# Altium schematic sheet Sheet2.SCHDOC
size 431 x 279 mm; SheetNumber: 0; SheetTotal: 0
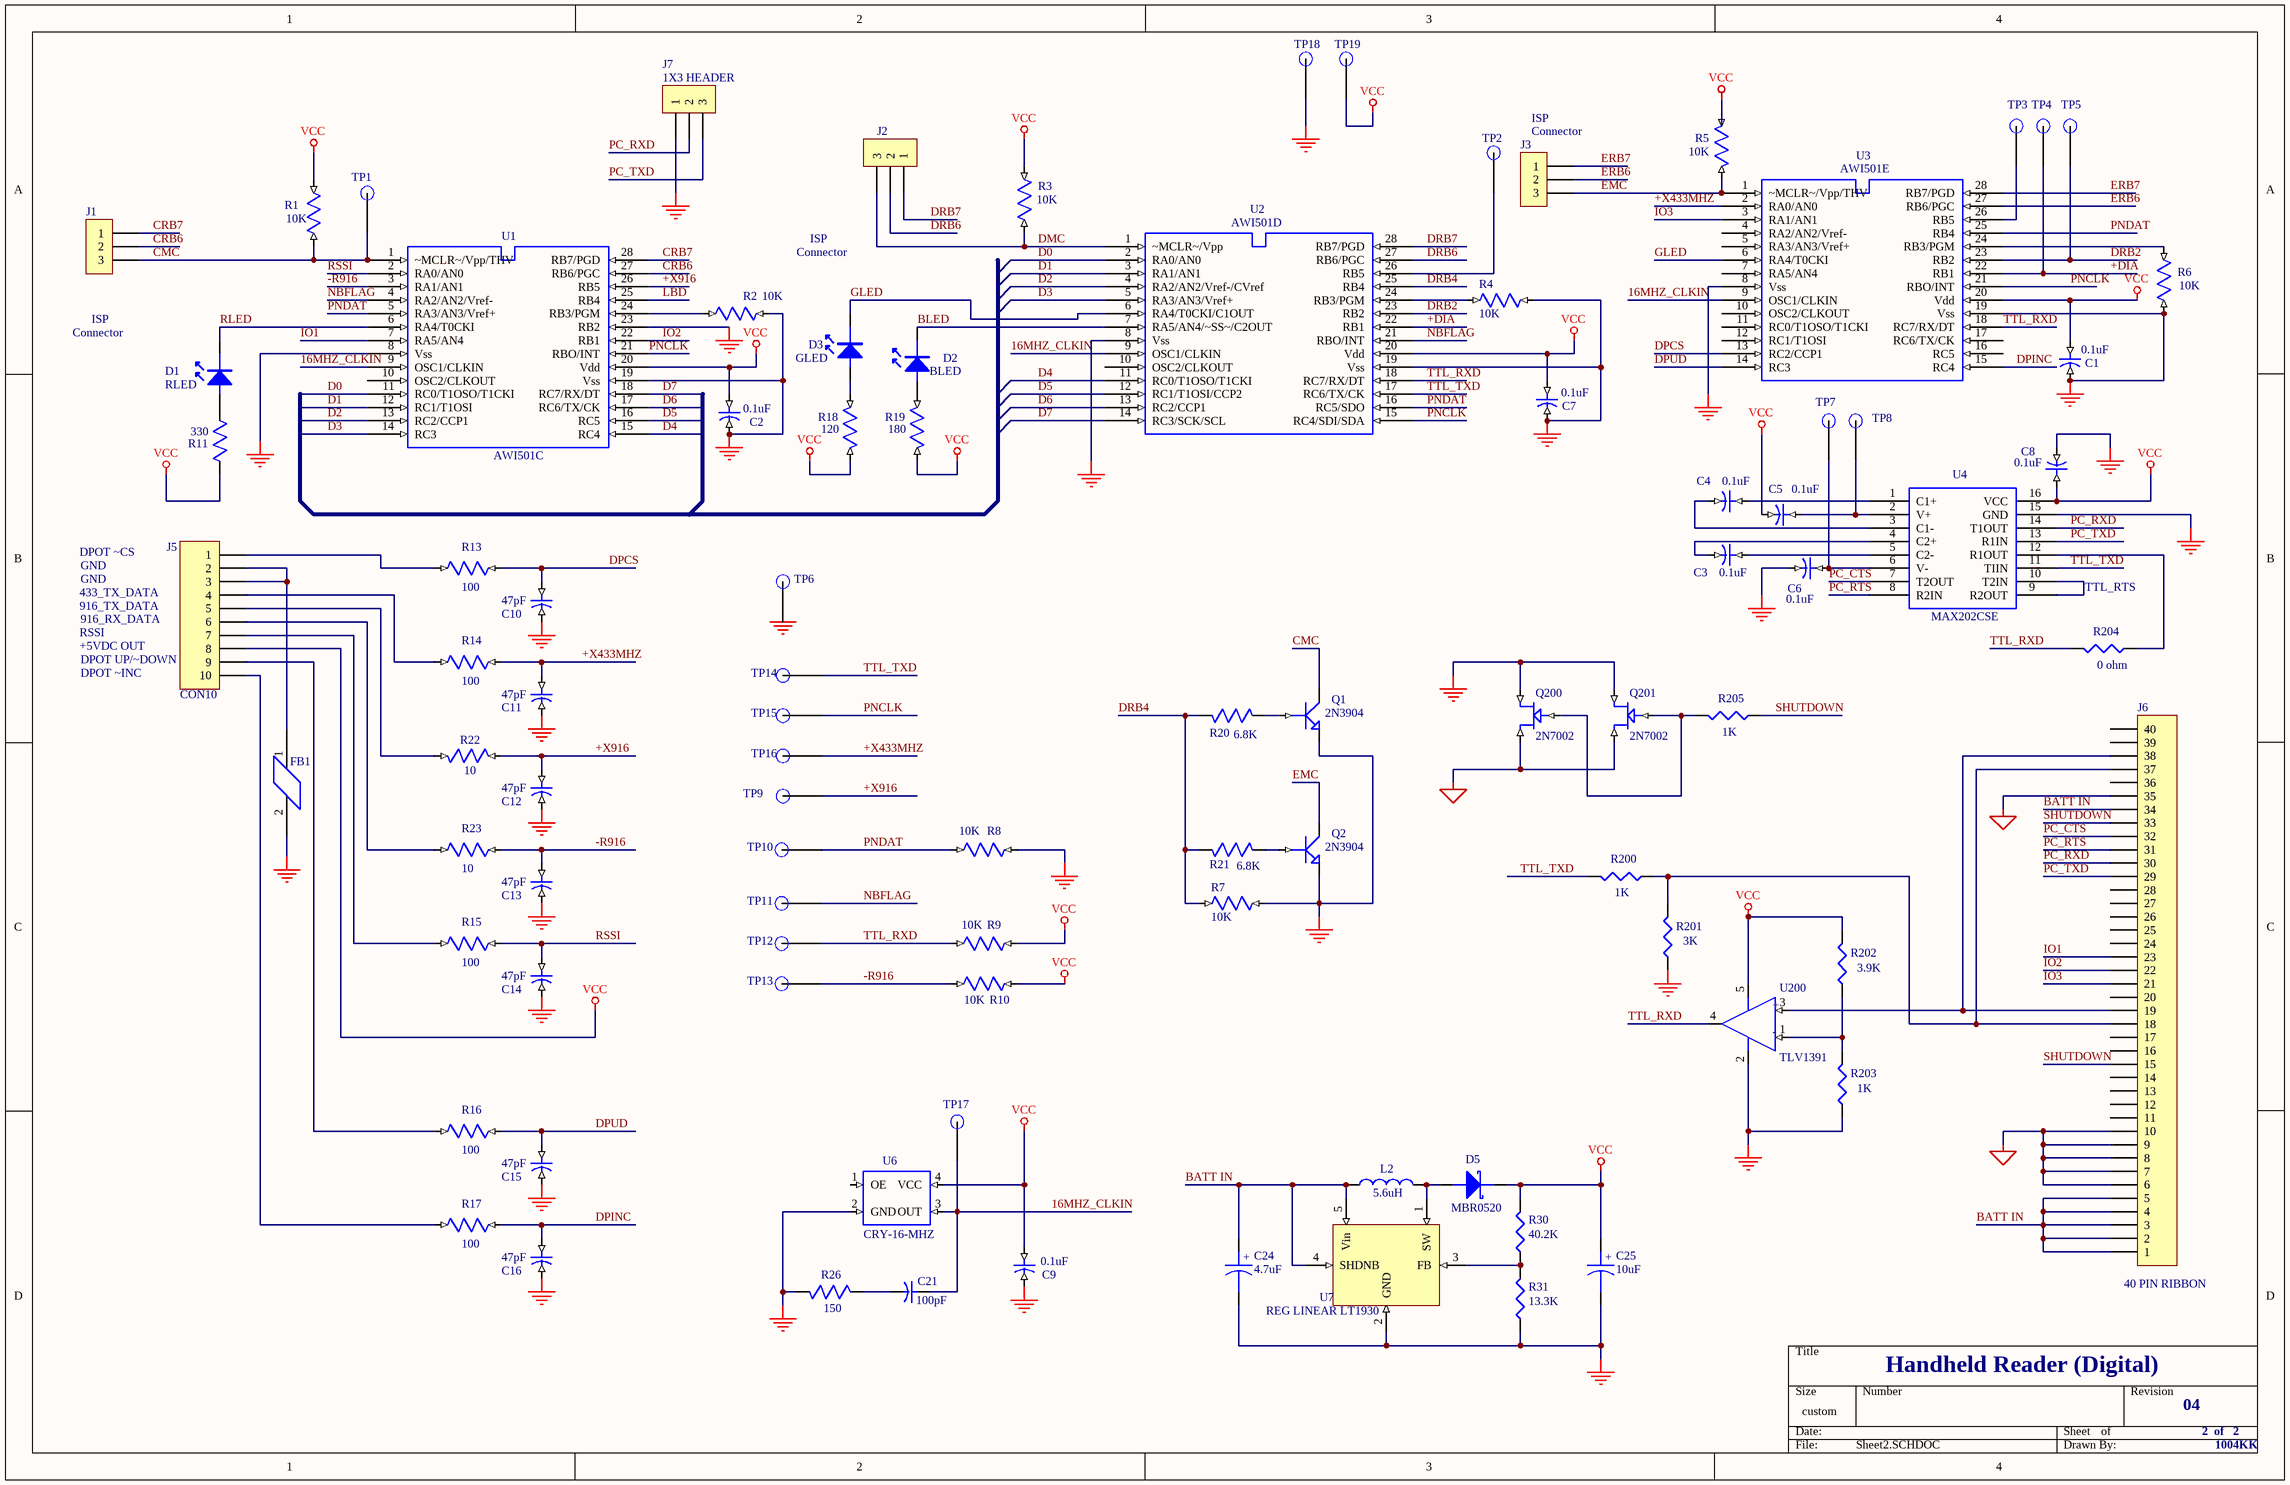
[diagram p0: Sheet2.SCHDOC]

## Parts
C1  0.1uF  [0603]
C2  0.1uF  [0603]
C3  0.1uF  [0603]
C4  0.1uF  [0603]
C5  0.1uF  [0603]
C6  0.1uF  [0603]
C7  0.1uF  [0603]
C8  0.1uF  [0603]
C9  0.1uF  [0603]
C10  47pF  [0603]
C11  47pF  [0603]
C12  47pF  [0603]
C13  47pF  [0603]
C14  47pF  [0603]
C15  47pF  [0603]
C16  47pF  [0603]
C21  100pF  [0603]
C24  4.7uF  [CAP A CASE]
C25  10uF  [CAP A CASE]
D1  RLED  [SOD123 DIODE]
D2  BLED  [SOD123 DIODE]
D3  GLED  [SOD123 DIODE]
D5  MBR0520  [SOD123]
FB1  FB 0603  [0603]  (value not drawn)
J1  1X3 HEADER  [1X3 HEADER]  (value not drawn)
J2  1X3 HEADER  [1X3 HEADER]  (value not drawn)
J3  1X3 HEADER  [1X3 HEADER]  (value not drawn)
J5  CON10  [1X10 HEADER SPECIAL]
J6  40 PIN RIBBON  [40 PIN RIBBON CONN]
J7  1X3 HEADER  [1X3 HEADER]
L2  5.6uH  [COIL BOURNS SDR7030-330M]
Q1  2N3904  [SOT23 TRANS]
Q2  2N3904  [SOT23 TRANS]
Q200  2N7002  [SOT23 FET]
Q201  2N7002  [SOT23 FET]
R1  10K  [0603]
R2  10K  [0603]
R3  10K  [0603]
R4  10K  [0603]
R5  10K  [0603]
R6  10K  [0603]
R7  10K  [0603]
R8  10K  [0603]
R9  10K  [0603]
R10  10K  [0603]
R11  330  [0603]
R13  100  [0603]
R14  100  [0603]
R15  100  [0603]
R16  100  [0603]
R17  100  [0603]
R18  120  [0603]
R19  180  [0603]
R20  6.8K  [0603]
R21  6.8K  [0603]
R22  10  [0603]
R23  10  [0603]
R26  150  [0603]
R30  40.2K  [0603]
R31  13.3K  [0603]
R200  1K  [0603]
R201  3K  [0603]
R202  3.9K  [0603]
R203  1K  [0603]
R204  0 ohm  [0603]
R205  1K  [0603]
TP1  TP  [TEST POINT PAD]  (value not drawn)
TP2  TP  [TEST POINT PAD]  (value not drawn)
TP3  TP  [TEST POINT PAD]  (value not drawn)
TP4  TP  [TEST POINT PAD]  (value not drawn)
TP5  TP  [TEST POINT PAD]  (value not drawn)
TP6  TP  [TEST POINT PAD]  (value not drawn)
TP7  TP  [TEST POINT PAD]  (value not drawn)
TP8  TP  [TEST POINT PAD]  (value not drawn)
TP9  TP  [TEST POINT PAD]  (value not drawn)
TP10  TP  [TEST POINT PAD]  (value not drawn)
TP11  TP  [TEST POINT PAD]  (value not drawn)
TP12  TP  [TEST POINT PAD]  (value not drawn)
TP13  TP  [TEST POINT PAD]  (value not drawn)
TP14  TP  [TEST POINT PAD]  (value not drawn)
TP15  TP  [TEST POINT PAD]  (value not drawn)
TP16  TP  [TEST POINT PAD]  (value not drawn)
TP17  TP  [TEST POINT PAD]  (value not drawn)
TP18  TP  [TEST POINT PAD]  (value not drawn)
TP19  TP  [TEST POINT PAD]  (value not drawn)
U1  AWI501C  [SSOP28]
U2  AWI501D  [SSOP28]
U3  AWI501E  [SSOP28]
U4  MAX202CSE  [SO16]
U6  CRY-16-MHZ  [SMT OSCILLATOR]
U7  REG LINEAR LT1930  [SOT23-5A]
U200  TLV1391  [SOT25]

## Nets
GND1: J6.6 J6.7 J6.8 J6.9 J6.10 J6.35 Q200.S Q201.S
GND_COM: C1.2(B) C2.2(B) C6.2(B) C7.2(B) C8.2(B) C9.2(B) C10.2(B) C11.2(B) C12.2(B) C13.2(B) C14.2(B) C15.2(B) C16.2(B) C24.2 C25.2 FB1.2 J7.1 Q1.E Q2.E Q200.D Q201.D R2.2(B) R4.1(A) R6.2(B) R7.2(B) R8.1(A) R26.2(B) R31.1 R201.1 R203.1 TP6.1(TP) TP18.1(TP) U1.8(Vss) U1.19(Vss) U1.23(RB2) U2.8(Vss) U2.19(Vss) U3.8(Vss) U3.19(Vss) U4.15(GND) U6.2(GND) U7.2(GND) U200.2(VSS)
VCC: C1.1(A) C2.1(A) C5.2(B) C7.1(A) C8.1(A) C9.1(A) C25.1 D5.K J5.8 R1.1(A) R3.1(A) R5.1(A) R9.1(A) R10.1(A) R11.1(A) R18.1(A) R19.1(A) R30.2 R202.2 TP19.1(TP) U1.20(Vdd) U2.20(Vdd) U3.20(Vdd) U4.16(VCC) U6.4(VCC) U200.5(VDD)
16MHZ_CLKIN: C21.1(A) TP17.1(TP) U1.9(OSC1/CLKIN) U2.9(OSC1/CLKIN) U3.9(OSC1/CLKIN) U6.3(OUT)
+DIA: TP4.1(TP) U2.22(RB1) U3.22(RB1)
+X433MHZ: C11.1(A) R14.2(B) TP16.1(TP) U3.2(RA0/AN0)
+X916: C12.1(A) R22.1(A) TP9.1(TP) U1.26(RB5)
-R916: C13.1(A) R10.2(B) R23.2(B) TP13.1(TP) U1.3(RA1/AN1)
BATT IN: C24.1 J6.1 J6.2 J6.3 J6.4 J6.5 J6.34 L2.1 U7.4(SHDNB) U7.5(Vin)
BLED: D2.K U2.7(RA5/AN4/~SS~/C2OUT)
CMC: J1.3 Q1.C R1.2(B) TP1.1(TP) U1.1(~MCLR~/Vpp/THV)
CRB6: J1.2 U1.27(RB6/PGC)
CRB7: J1.1 U1.28(RB7/PGD)
D0: U1.11(RC0/T1OSO/T1CKI) U2.2(RA0/AN0)
D1: U1.12(RC1/T1OSI) U2.3(RA1/AN1)
D2: U1.13(RC2/CCP1) U2.4(RA2/AN2/Vref-/CVref)
D3: U1.14(RC3) U2.5(RA3/AN3/Vref+)
D4: U1.15(RC4) U2.11(RC0/T1OSO/T1CKI)
D5: U1.16(RC5) U2.12(RC1/T1OSI/CCP2)
D6: U1.17(RC6/TX/CK) U2.13(RC2/CCP1)
D7: U1.18(RC7/RX/DT) U2.14(RC3/SCK/SCL)
DMC: J2.3 R3.2(B) U2.1(~MCLR~/Vpp)
DPCS: C10.1(A) R13.2(B) U3.13(RC2/CCP1)
DPINC: C16.1(A) R17.2(B) U3.15(RC4)
DPUD: C15.1(A) R16.2(B) U3.14(RC3)
DRB2: TP5.1(TP) U2.23(RB2) U3.23(RB2)
DRB4: R7.1(A) R20.1(A) R21.1(A) U2.25(RB4)
DRB6: J2.2 U2.27(RB6/PGC)
DRB7: J2.1 U2.28(RB7/PGD)
EMC: J3.3 Q2.C R5.2(B) U3.1(~MCLR~/Vpp/THV)
ERB6: J3.2 U3.27(RB6/PGC)
ERB7: J3.1 U3.28(RB7/PGD)
GLED: D3.K U2.6(RA4/T0CKI/C1OUT) U3.6(RA4/T0CKI)
IO1: J6.23 U1.7(RA5/AN4)
IO2: J6.22 U1.22(RB1)
IO3: J6.21 U3.3(RA1/AN1)
LBD: U1.25(RB4)
NBFLAG: TP11.1(TP) U1.4(RA2/AN2/Vref-) U2.21(RBO/INT)
PC_CTS: J6.32 U4.7(T2OUT)
PC_RTS: J6.31 U4.8(R2IN)
PC_RXD: J6.30 J7.2 U4.14(T1OUT)
PC_TXD: J6.29 J7.3 U4.13(R1IN)
PNCLK: TP15.1(TP) U1.21(RBO/INT) U2.15(RC4/SDI/SDA) U3.21(RBO/INT)
PNDAT: R8.2(B) TP10.1(TP) U1.5(RA3/AN3/Vref+) U2.16(RC5/SDO) U3.25(RB4)
RLED: D1.K U1.6(RA4/T0CKI)
RSSI: C14.1(A) R15.2(B) U1.2(RA0/AN0)
SHUTDOWN: J6.15 J6.33 R205.1
TTL_RXD: R9.2(B) R204.2 TP12.1(TP) U2.18(RC7/RX/DT) U3.18(RC7/RX/DT) U200.4(OUT)
TTL_TXD: R200.2 TP14.1(TP) U2.17(RC6/TX/CK) U4.11(TIIN)
NetC3_1: C3.1(A) U4.5(C2-)
NetC3_2: C3.2(B) U4.4(C2+)
NetC4_1: C4.1(A) U4.1(C1+)
NetC4_2: C4.2(B) U4.3(C1-)
NetC5_1: C5.1(A) TP8.1(TP) U4.2(V+)
NetC6_1: C6.1(A) TP7.1(TP) U4.6(V-)
NetC21_2: C21.2(B) R26.1(A)
NetD1_A: D1.A R11.2(B)
NetD2_A: D2.A R19.2(B)
NetD3_A: D3.A R18.2(B)
NetD5_A: D5.A L2.2 U7.1(SW)
NetFB1_1: FB1.1 J5.2 J5.3
NetJ5_1: J5.1 R13.1(A)
NetJ5_4: J5.4 R14.1(A)
NetJ5_5: J5.5 R22.2(B)
NetJ5_6: J5.6 R23.1(A)
NetJ5_7: J5.7 R15.1(A)
NetJ5_9: J5.9 R16.1(A)
NetJ5_10: J5.10 R17.1(A)
NetJ6_18: J6.18 J6.37 R200.1 R201.2
NetJ6_19: J6.19 J6.38 U200.3(+)
NetQ1_B: Q1.B R20.2(B)
NetQ2_B: Q2.B R21.2(B)
NetQ200_G: Q200.G Q201.G R205.2
NetR2_1: R2.1(A) U1.24(RB3/PGM)
NetR4_2: R4.2(B) U2.24(RB3/PGM)
NetR6_1: R6.1(A) U3.24(RB3/PGM)
NetR30_1: R30.1 R31.2 U7.3(FB)
NetR202_1: R202.1 R203.2 U200.1(-)
NetR204_1: R204.1 U4.12(R1OUT)
NetTP2_1: TP2.1(TP) U2.26(RB5)
NetTP3_1: TP3.1(TP) U3.26(RB5)
NetU4_9: U4.9(R2OUT) U4.10(T2IN)

Not connected (* = marked no-connect by the designer): J6 11 12 13 14 16 17 20 24 25 26 27 28 36 39 40; U1 10(OSC2/CLKOUT); U2 10(OSC2/CLKOUT); U3 4(RA2/AN2/Vref-) 5(RA3/AN3/Vref+) 7(RA5/AN4) 10(OSC2/CLKOUT) 11(RC0/T1OSO/T1CKI) 12(RC1/T1OSI) 16(RC5) 17(RC6/TX/CK); U6 1(OE)

## Notes on the sheet
- ISP
- Connector
- DPOT ~CS
- GND
- 916_TX_DATA
- 433_TX_DATA
- RSSI
- 916_RX_DATA
- TTL_RTS
- +5VDC OUT
- DPOT ~INC
- DPOT UP/~DOWN
- Handheld Reader (Digital)
- 04
- 2  of   2
- 1004KK
- (in symbol CAPACITOR POL) +

## Library data of the parts
C1-C9 = C_603: Part Field 1: Part Number ECJ-1VF1H104Z; Part Field 2: Vendor Panasonic - ECG; Part Field 3: Description CAP .1UF 50V CERAMIC Y5V 0603
C10-C16 = C0603: Part Field 1: Part Number 0603N470J500NT; Part Field 2: Vendor BC Components; Part Field 3: Description Cap, Ceramic, 47pF, 50V, NP0, 0603, SMD
C21 = C_0603: Part Field 1: Part Number ECJ-1VC1H101J; Part Field 2: Vendor Panasonic - ECG; Part Field 3: Description CAP CERAMIC 100PF 50V 0603 SMD
C24 C25 = CAPACITOR POL: Capacitor
D1-D3 = LED
D5 = DIODE SCHOTTKY: Schottky Diode
FB1 = FB_0603: Part Field 1: Part Number EXC-ML16A270U; Part Field 2: Vendor Panasonic - ECG; Part Field 3: Description BEAD CORE 27 OHM 4A 0603 SMD
J1-J3 J7 = CON3: Connector
J5 = CON10: Connector
J6 = CON40: Connector
L2 = INDUCTOR1
Q1 Q2 = NPN1: NPN Transistor
Q200 Q201 = JFET N
R1-R10 = R_603: Part Field 1: Part Number ERA-V15J103V; Part Field 2: Vendor Panasonic - ECG; Part Field 3: Description RES 10K OHM 1/16W 1500PPM 5%0603
R11 = R_0603: Part Field 1: Part Number ERJ-3GEYJ331V; Part Field 2: Vendor Panasonic - ECG; Part Field 3: Description RES 330 OHM 1/10W 5% 0603 SMD
R13-R17 R23 = R0603: Part Field 1: Part Number 9C06031A1000JLHFT; Part Field 2: Vendor Yageo America; Part Field 3: Description RES, 100 OHM, 1/10W, 5%, 0603, SMD
R18 = R0402: Part Field 1: Part Number ERJ-3GEYJ121V; Part Field 2: Vendor Panasonic - ECG; Part Field 3: Description RES 120 OHM 1/10W 5% 0603 SMD
R19 = R0402: Part Field 1: Part Number ERJ-3GEYJ181V; Part Field 2: Vendor Panasonic - ECG; Part Field 3: Description RES 180 OHM 1/10W 5% 0603 SMD
R20 R21 = R_0603: Part Field 1: Part Number ERJ-3GEYJ682V; Part Field 2: Vendor Panasonic - ECG; Part Field 3: Description RES 6.8K OHM 1/10W 5% 0603 SMD
R22 = R_603: Part Field 1: Part Number 9C06031A10R0FKHFT; Part Field 2: Vendor Yageo America; Part Field 3: Description RES, 10, OHM, 1/16W, 5%, 0603, SMD
R26 = R_0603: Part Field 1: Part Number 9C06031A1500JLHFT; Part Field 2: Vendor Yageo America; Part Field 3: Description RES 150 OHM 1/16W 5% 0603 SMD
R30 R31 R200-R205 = RES1
TP1-TP19 = TESTPOINT_1
U1 U3 = PIC16F870: Part Field 1: Part Number PIC16F870-E/SO; Part Field 2: Vendor Microchip Technology; Part Field 3: Description IC MCU CMOS 20MHZ 2K FLSH 28SOIC
U2 = PIC16F876A: Part Field 1: Part Number PIC16F876A-E/SO; Part Field 2: Vendor Microchip Technology; Part Field 3: Description IC MCU FLASH 8KX14 W/AD 28-SOIC
U4 = MAX202CSE: Part Field 1: Part Number MAX202CSE; Part Field 2: Vendor Maxim; Part Field 3: Description IC TRANSCEIVER RS232 5V 16-SOIC
U6 = CRY-SMD-5-7
U200 = TLV1391: Text Field1: 40; Text Field2: 40